# Altium project Master_V1.PrjPCB
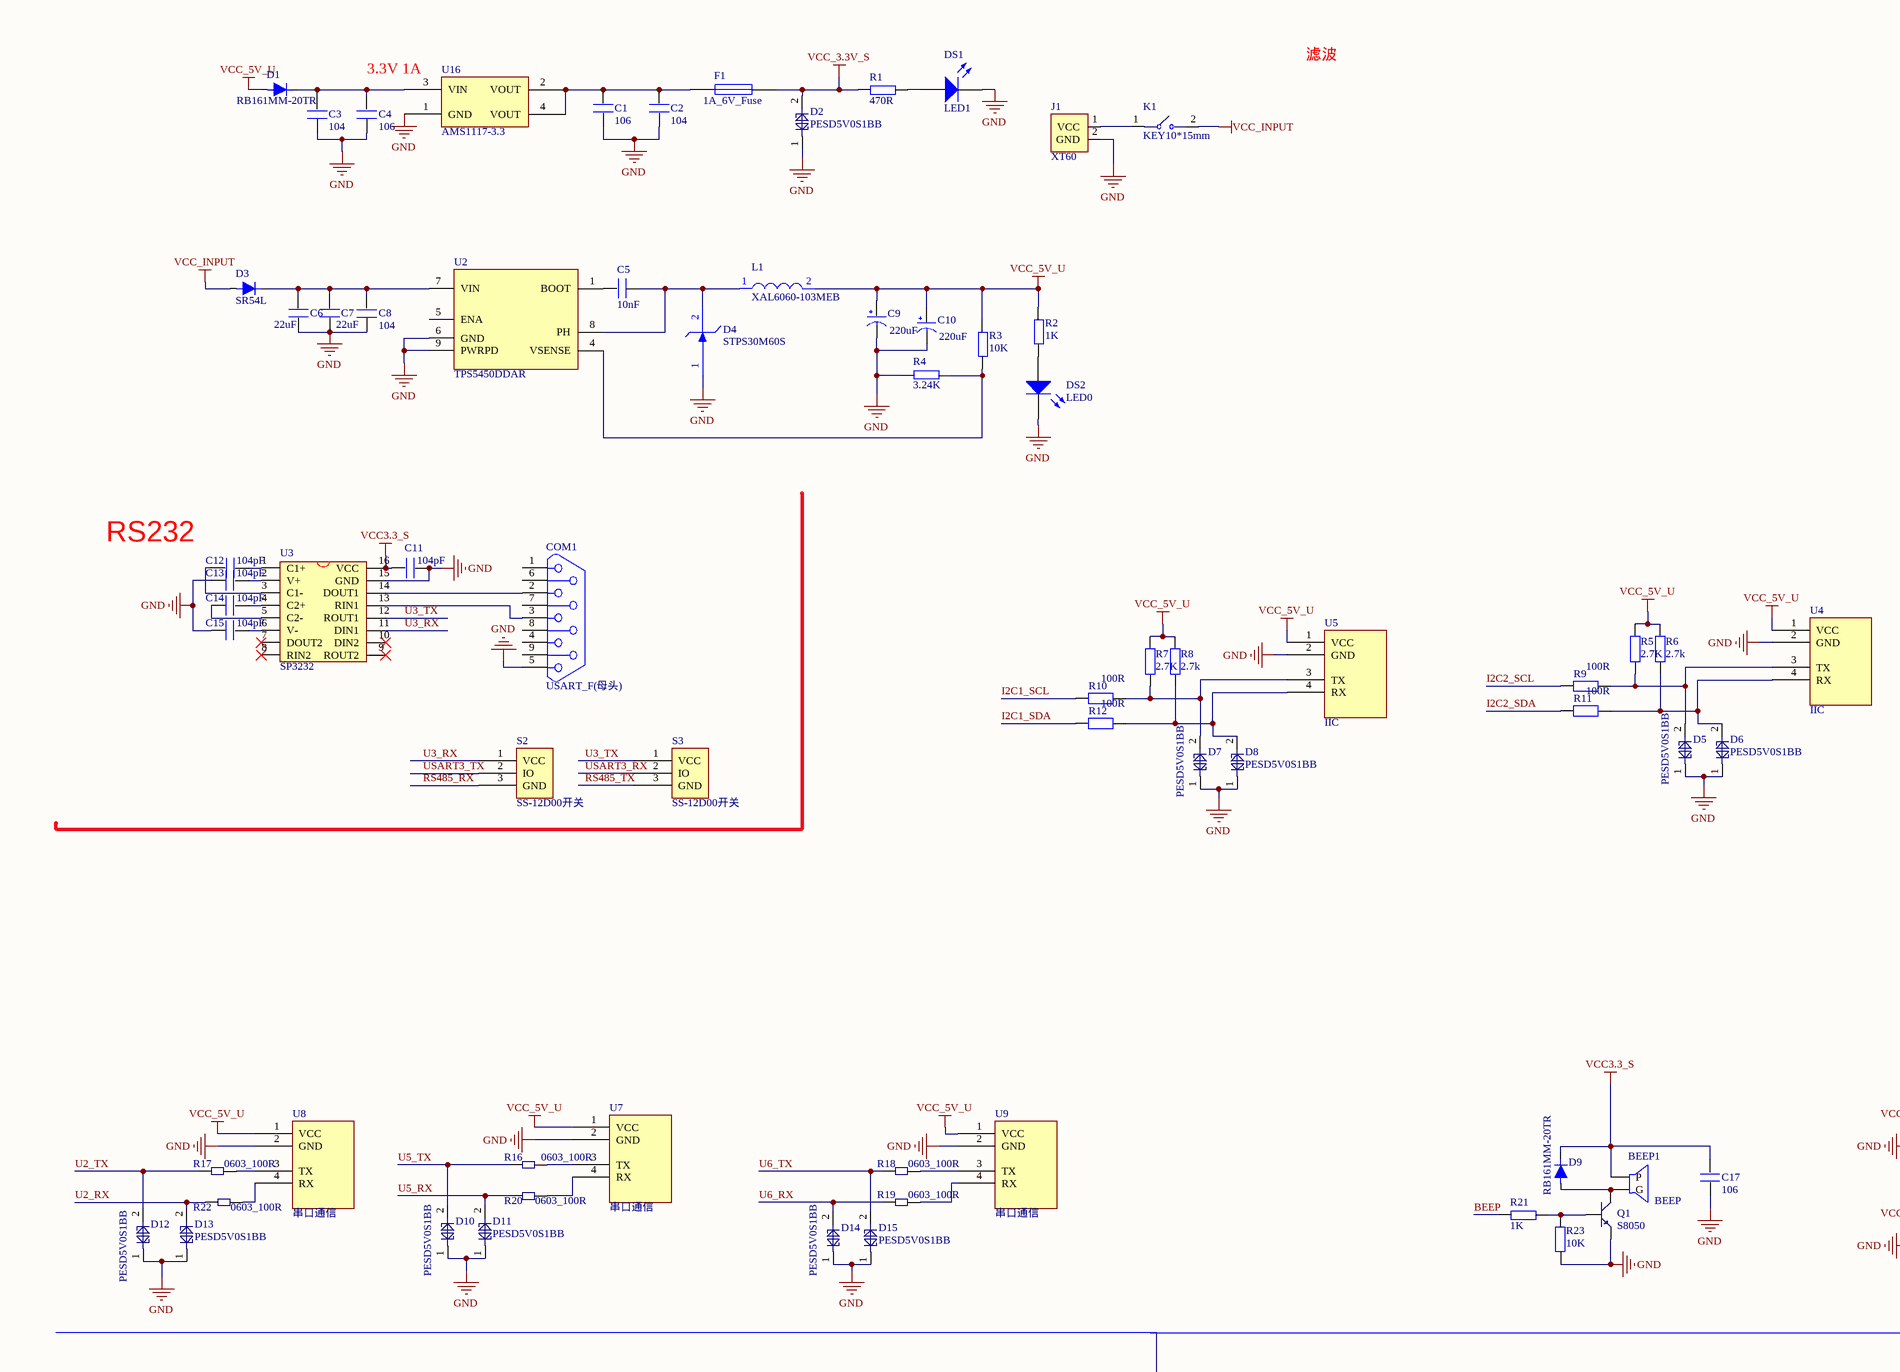
[diagram p0: Master_V1.SchDoc, top left]
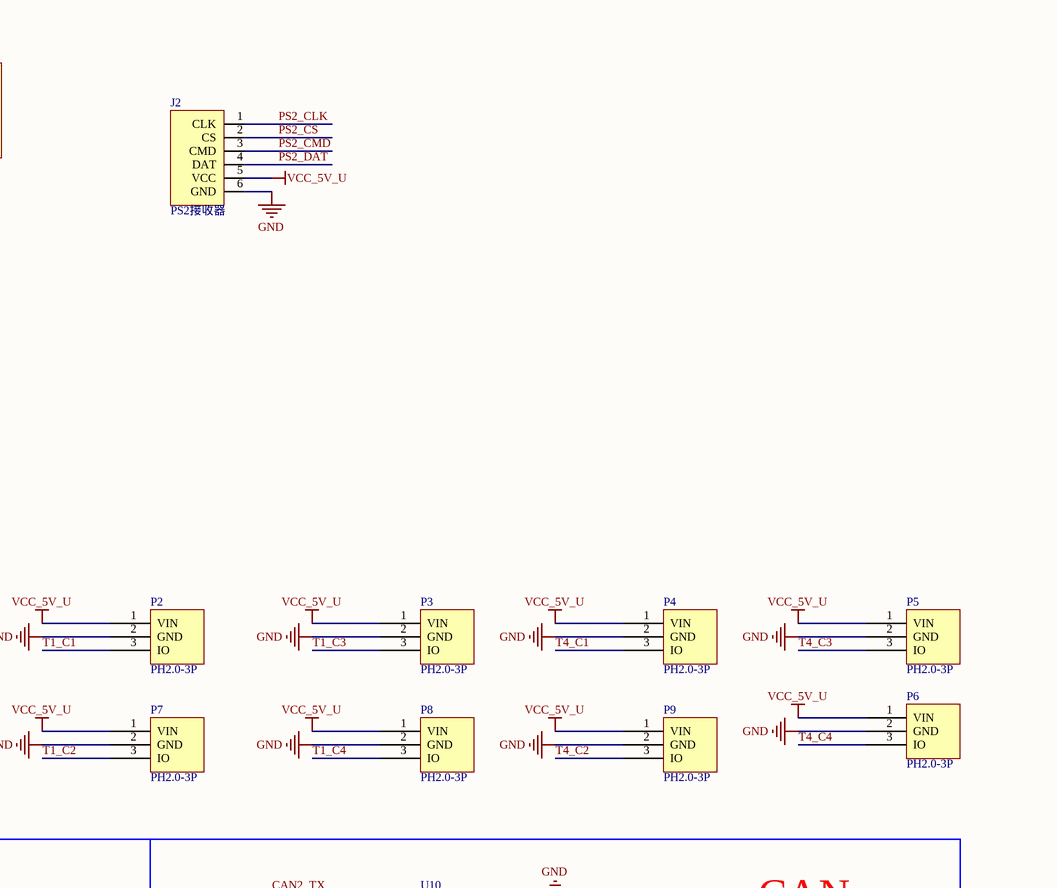
[diagram p1: Master_V1.SchDoc, top right]
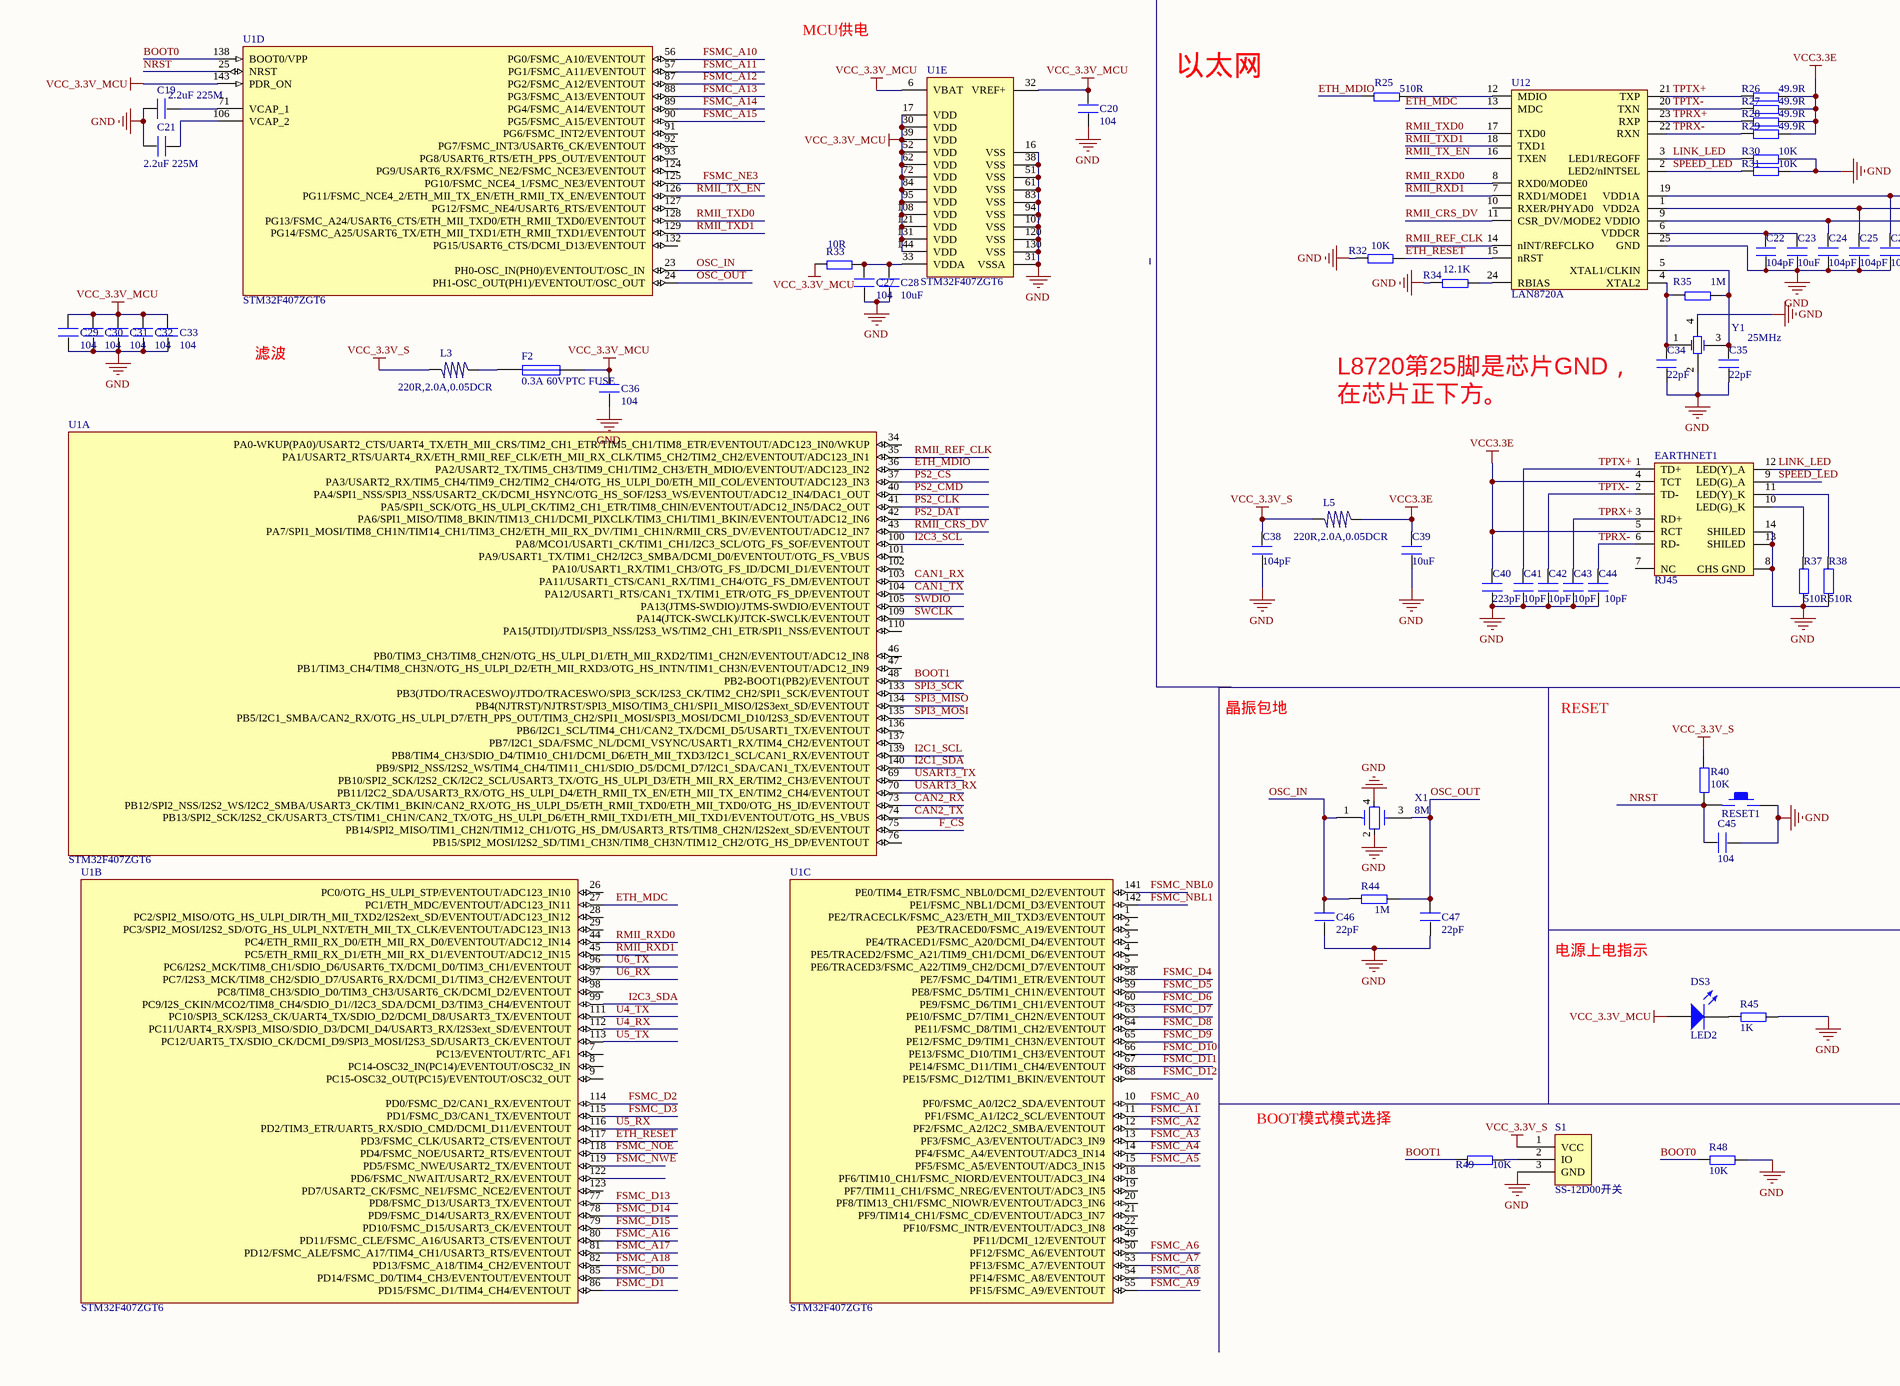
[diagram p2: Master_V1.SchDoc, bottom left]
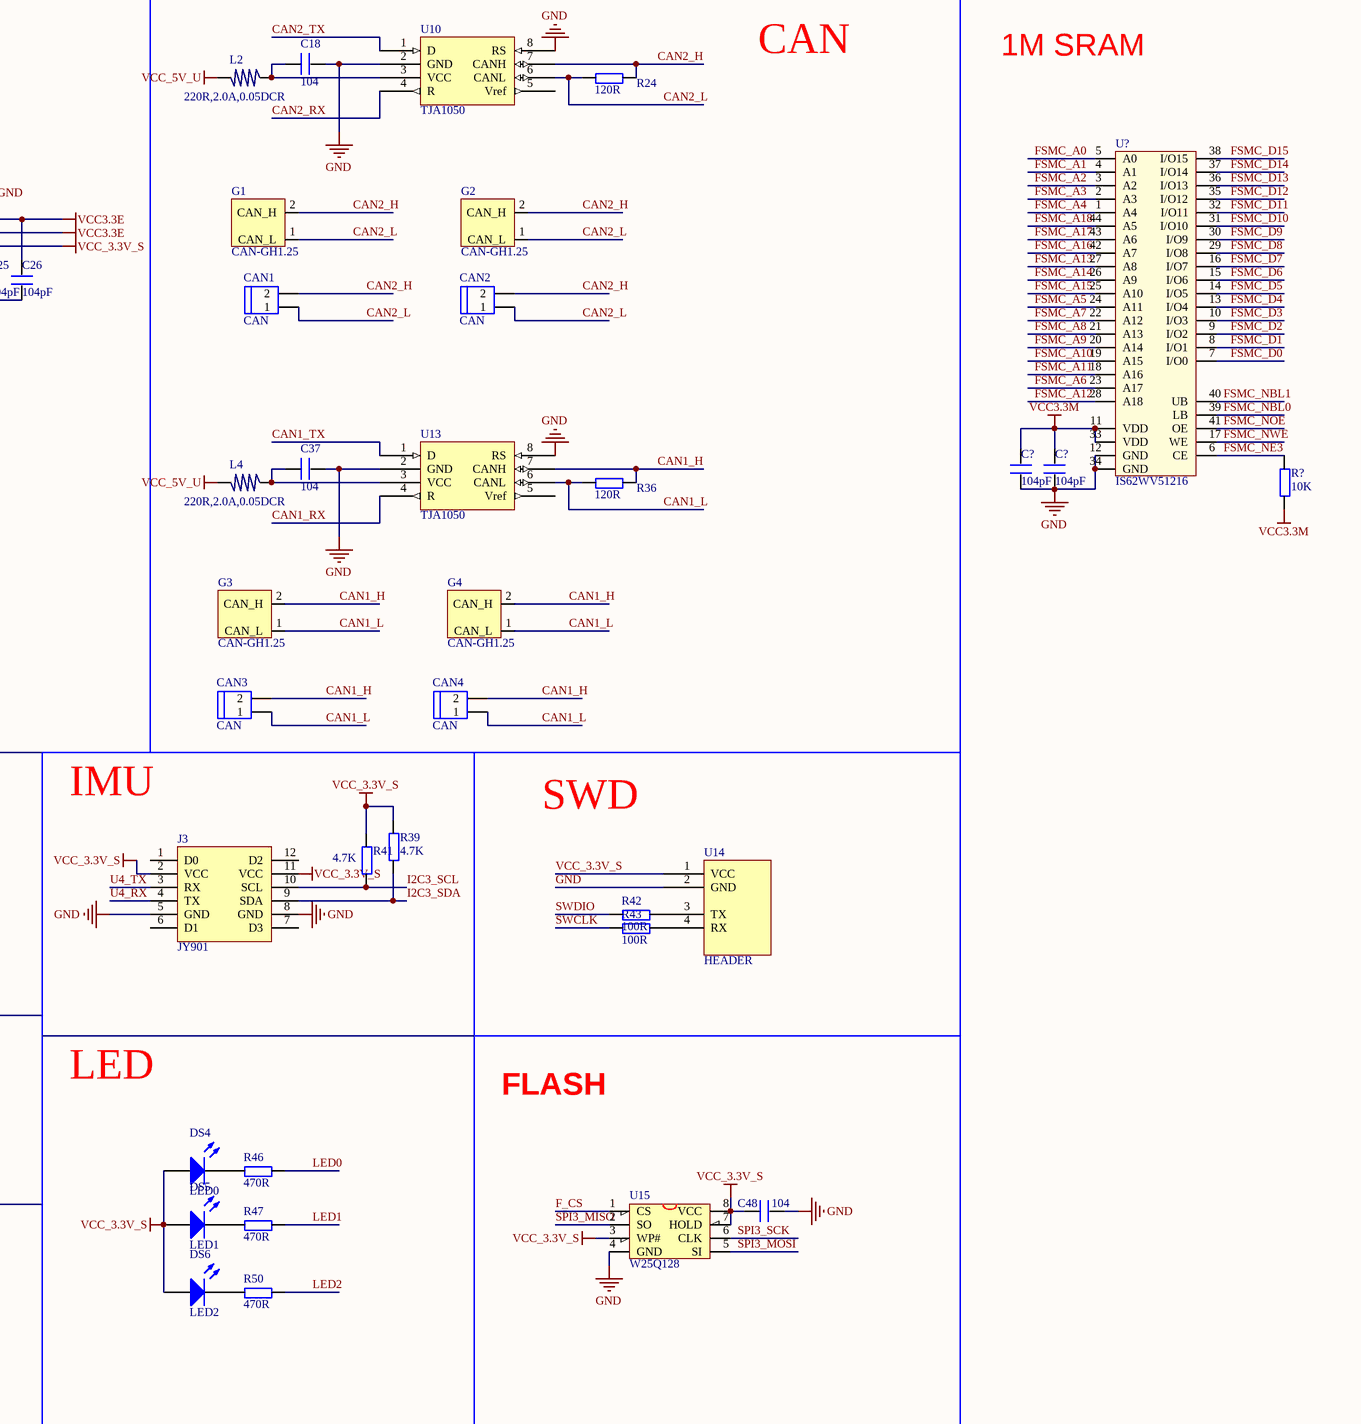
[diagram p3: Master_V1.SchDoc, bottom right]
1 sheet, 170 parts. Net scope: global (net labels, ports and power ports of the same name join across sheets).
Board file: Master_V1.PcbDoc

## Sheet Master_V1.SchDoc
size A1

### Parts
(Parts that share a designator on the sheet are numbered #1, #2 ... from top to bottom, then left to right.)
BEEP1  BEEP  [BELL-5]
C1  106  [0603C]
C2  104  [0603C]
C3  104  [0603C]
C4  106  [0603C]
C5  10nF  [0603C]
C6  22uF  [0603C]
C7  22uF  [0603C]
C8  104  [0603C]
C9  220uF  [CC6.56.5]
C10  220uF  [CC6.56.5]
C11  104pF  [C0603]
C12  104pF  [C0603]
C13  104pF  [C0603]
C14  104pF  [C0603]
C15  104pF  [C0603]
C17  106  [0603C]
C18  104  [0603P]
C19  2.2uF 225M  [0603C]
C20  104  [0603C]
C21  2.2uF 225M  [0603C]
C22  104pF  [C0603]
C23  10uF  [0603C]
C24  104pF  [C0603]
C25  104pF  [C0603]
C26  104pF  [C0603]
C27  104  [0603C]
C28  10uF  [0603C]
C29  104  [0603C]
C30  104  [0603C]
C31  104  [0603C]
C32  104  [0603C]
C33  104  [0603C]
C34  22pF  [C0603]
C35  22pF  [C0603]
C36  104  [0603C]
C37  104  [0603P]
C38  104pF  [C0603]
C39  10uF  [0603C]
C40  223pF  [C0603]
C41  10pF  [C0603]
C42  10pF  [C0603]
C43  10pF  [C0603]
C44  10pF  [C0603]
C45  104  [0603C]
C46  22pF  [0603C]
C47  22pF  [0603C]
C48  104  [0603C]
C?#1  104pF  [C0603]
C?#2  104pF  [C0603]
CAN1  CAN  [HEAD2L-0.8]
CAN2  CAN  [HEAD2L-0.8]
CAN3  CAN  [HEAD2L-0.8]
CAN4  CAN  [HEAD2L-0.8]
COM1  USART_F(母头)  [DB9]
D1  RB161MM-20TR  [LC-SOD-123F]
D2  PESD5V0S1BB  [LC-SOD-523]
D3  SR54L  [LC-SMB(DO-214AA)_S2]
D4  STPS30M60S  [STPS30M60S]
D5  PESD5V0S1BB  [LC-SOD-523]
D6  PESD5V0S1BB  [LC-SOD-523]
D7  PESD5V0S1BB  [LC-SOD-523]
D8  PESD5V0S1BB  [LC-SOD-523]
D9  RB161MM-20TR  [LC-SOD-123F]
D10  PESD5V0S1BB  [LC-SOD-523]
D11  PESD5V0S1BB  [LC-SOD-523]
D12  PESD5V0S1BB  [LC-SOD-523]
D13  PESD5V0S1BB  [LC-SOD-523]
D14  PESD5V0S1BB  [LC-SOD-523]
D15  PESD5V0S1BB  [LC-SOD-523]
DS1  LED1  [0603_LED]
DS2  LED0  [0603_LED]
DS3  LED2  [0603_LED]
DS4  LED0  [0603_LED]
DS5  LED1  [0603_LED]
DS6  LED2  [0603_LED]
EARTHNET1  RJ45  [HR911105A]
F1  1A_6V_Fuse  [LC-1206]
F2  0.3A 60VPTC FUSE  [LC-1812_R]
G1  CAN-GH1.25  [GH1.25_1*2_lishi]
G2  CAN-GH1.25  [GH1.25_1*2_lishi]
G3  CAN-GH1.25  [GH1.25_1*2_lishi]
G4  CAN-GH1.25  [GH1.25_1*2_lishi]
J1  XT60  [XT60-母头]
J2  PS2接收器  [HDR1X6]
J3  JY901  [JY901]
K1  KEY10*15mm  [10*15mm船型开关]
L1  XAL6060-103MEB  [XAL6060-103MEB]
L2  220R,2.0A,0.05DCR  [0603P]
L3  220R,2.0A,0.05DCR  [0603C]
L4  220R,2.0A,0.05DCR  [0603P]
L5  220R,2.0A,0.05DCR  [R0603]
P2  PH2.0-3P  [PH2.0-3]
P3  PH2.0-3P  [PH2.0-3]
P4  PH2.0-3P  [PH2.0-3]
P5  PH2.0-3P  [PH2.0-3]
P6  PH2.0-3P  [PH2.0-3]
P7  PH2.0-3P  [PH2.0-3]
P8  PH2.0-3P  [PH2.0-3]
P9  PH2.0-3P  [PH2.0-3]
Q1  S8050  [SOT-23R]
R1  470R  [0603R]
R2  1K  [0603R]
R3  10K  [0603R]
R4  3.24K  [0603R]
R5  2.7K  [0603R]
R6  2.7k  [0603R]
R7  2.7K  [0603R]
R8  2.7k  [0603R]
R9  100R  [0603R]
R10  100R  [0603R]
R11  100R  [0603R]
R12  100R  [0603R]
R16  0603_100R  [0603R]
R17  0603_100R  [0603R]
R18  0603_100R  [0603R]
R19  0603_100R  [0603R]
R20  0603_100R  [0603R]
R21  1K  [0603R]
R22  0603_100R  [0603R]
R23  10K  [0603R]
R24  120R  [0603P]
R25  510R  [R0603]
R26  49.9R  [R0603]
R27  49.9R  [R0603]
R28  49.9R  [R0603]
R29  49.9R  [R0603]
R30  10K  [R0603]
R31  10K  [R0603]
R32  10K  [R0603]
R33  10R  [0603R]
R34  12.1K  [R0603]
R35  1M  [R0603]
R36  120R  [0603P]
R37  510R  [R0603]
R38  510R  [R0603]
R39  4.7K  [0603P]
R40  10K  [0603R]
R41  4.7K  [0603P]
R42  100R  [0603P]
R43  100R  [0603P]
R44  1M  [0603R]
R45  1K  [0603R]
R46  470R  [0603R]
R47  470R  [0603R]
R48  10K  [0603R]
R49  10K  [0603R]
R50  470R  [0603R]
R?  10K  [R0603]
RESET1  KEY_M  [KEY_M]  (value not drawn)
S1  SS-12D00开关  [SS-12D00]
S2  SS-12D00开关  [SS-12D00]
S3  SS-12D00开关  [SS-12D00]
U1  STM32F407ZGT6  [LQFP144]  (parts A,B,C,D,E of 5)
U2  TPS5450DDAR  [TPS5450]
U3  SP3232  [SOP16M]
U4  IIC  [XH2.54-4]
U5  IIC  [XH2.54-4]
U7  串口通信  [XH2.54-4]
U8  串口通信  [XH2.54-4]
U9  串口通信  [XH2.54-4]
U10  TJA1050  [SOP8]
U12  LAN8720A  [QFN25]
U13  TJA1050  [SOP8]
U14  HEADER  [XH2.54-4]
U15  W25Q128  [SOIC-8]
U16  AMS1117-3.3  [SOT223]
U?  IS62WV51216  [TSOP44]
X1  8M  [XTAL3225   无源]
Y1  25MHz  [SMD-3225]

### Nets
GND: C1.2 C2.2 C3.2 C4.2 C6.1 C7.1 C8.2 C9.2(GND) C10.2(GND) C11.2 C13.1 C15.1 C17.2 C18.2 C19.1 C20.1 C21.2 C22.1 C23.1 C24.1 C25.1 C26.1 C27.1 C28.1 C29.1 C30.1 C31.1 C32.1 C33.1 C34.1 C35.1 C36.1 C37.2 C38.1 C39.1 C40.1 C41.1 C42.1 C43.1 C44.1 C45.2 C46.1 C47.1 C48.2 C?#1.1 C?#2.1 COM1.5 D2.1(A) D4.1(A) D5.1(A) D6.1(A) D7.1(A) D8.1(A) D10.1(A) D11.1(A) D12.1(A) D13.1(A) D14.1(A) D15.1(A) DS1.2(K) DS2.2(K) EARTHNET1.8(CHS_GND) EARTHNET1.13(SHILED) EARTHNET1.14(SHILED) J1.2(GND) J2.6(GND) J3.5(GND) J3.8(GND) P2.2(GND) P3.2(GND) P4.2(GND) P5.2(GND) P6.2(GND) P7.2(GND) P8.2(GND) P9.2(GND) Q1.1(E) R4.2 R23.2 R30.2 R31.2 R32.1 R34.1 R37.1 R38.1 R45.2 R48.2 RESET1.2 S1.3(GND) U1.16(VSS) U1.31(VSSA) U1.38(VSS) U1.51(VSS) U1.61(VSS) U1.83(VSS) U1.94(VSS) U1.107(VSS) U1.120(VSS) U1.130(VSS) U2.6(GND) U2.9(PWRPD) U3.15(GND) U4.2(GND) U5.2(GND) U7.2(GND) U8.2(GND) U9.2(GND) U10.2(GND) U10.8(RS) U12.25(GND) U13.2(GND) U13.8(RS) U14.2(GND) U15.4(GND) U16.1(GND) U?.12(GND) U?.34(GND) X1.2 X1.4 Y1.2 Y1.4
VCC3.3_S: BEEP1.1(P) C11.1 C17.1 D9.2 U3.16(VCC)
VCC3.3E: C25.2 C26.2 C39.2 C40.2 EARTHNET1.4(TCT) EARTHNET1.5(RCT) L5.1 R26.2 R27.2 R28.2 R29.2 U12.1(VDD2A) U12.19(VDD1A)
VCC3.3M: C?#1.2 C?#2.2 R?.1 U?.11(VDD) U?.33(VDD)
VCC_3.3V_MCU: C20.2 C29.2 C30.2 C31.2 C32.2 C33.2 C36.2 DS3.1(A) F2.2 R33.1 U1.6(VBAT) U1.17(VDD) U1.30(VDD) U1.32(VREF+) U1.39(VDD) U1.52(VDD) U1.62(VDD) U1.72(VDD) U1.84(VDD) U1.95(VDD) U1.108(VDD) U1.121(VDD) U1.131(VDD) U1.143(PDR_ON) U1.144(VDD)
VCC_3.3V_S: C24.2 C38.2 C48.1 D2.2(C) DS4.1(A) DS5.1(A) DS6.1(A) F1.1 J3.2(VCC) J3.11(VCC) L3.2 L5.2 R1.1 R39.2 R40.2 R41.2 S1.1(VCC) U12.9(VDDIO) U14.1(VCC) U15.3(WP#) U15.7(HOLD) U15.8(VCC)
VCC_5V_U: C9.1(VCC) C10.1(VCC) D1.1 J2.5(VCC) L1.2(VIN) L2.2 L4.2 P2.1(VIN) P3.1(VIN) P4.1(VIN) P5.1(VIN) P6.1(VIN) P7.1(VIN) P8.1(VIN) P9.1(VIN) R2.2 R3.2 R5.2 R6.2 R7.2 R8.2 U4.1(VCC) U5.1(VCC) U7.1(VCC) U8.1(VCC) U9.1(VCC)
VCC_INPUT: D3.1 K1.2
BEEP: R21.1
BOOT0: R48.1 U1.138(BOOT0/VPP)
BOOT1: R49.1 U1.48(PB2-BOOT1(PB2)/EVENTOUT)
CAN1_H: CAN3.2 CAN4.2 G3.2(CAN_H) G4.2(CAN_H) R36.2 U13.7(CANH)
CAN1_L: CAN3.1 CAN4.1 G3.1(CAN_L) G4.1(CAN_L) R36.1 U13.6(CANL)
CAN1_RX: U1.103(PA11/USART1_CTS/CAN1_RX/TIM1_CH4/OTG_FS_DM/EVENTOUT) U13.4(R)
CAN1_TX: U1.104(PA12/USART1_RTS/CAN1_TX/TIM1_ETR/OTG_FS_DP/EVENTOUT) U13.1(D)
CAN2_H: CAN1.2 CAN2.2 G1.2(CAN_H) G2.2(CAN_H) R24.2 U10.7(CANH)
CAN2_L: CAN1.1 CAN2.1 G1.1(CAN_L) G2.1(CAN_L) R24.1 U10.6(CANL)
CAN2_RX: U1.73(PB12/SPI2_NSS/I2S2_WS/I2C2_SMBA/USART3_CK/TIM1_BKIN/CAN2_RX/OTG_HS_ULPI_D5/ETH_RMII_TXD0/ETH_MII_TXD0/OTG_HS_ID/EVENTOUT) U10.4(R)
CAN2_TX: U1.74(PB13/SPI2_SCK/I2S2_CK/USART3_CTS/TIM1_CH1N/CAN2_TX/OTG_HS_ULPI_D6/ETH_RMII_TXD1/ETH_MII_TXD1/EVENTOUT/OTG_HS_VBUS) U10.1(D)
ETH_MDC: U1.27(PC1/ETH_MDC/EVENTOUT/ADC123_IN11) U12.13(MDC)
ETH_MDIO: R25.1 U1.36(PA2/USART2_TX/TIM5_CH3/TIM9_CH1/TIM2_CH3/ETH_MDIO/EVENTOUT/ADC123_IN2)
ETH_RESET: R32.2 U1.117(PD3/FSMC_CLK/USART2_CTS/EVENTOUT) U12.15(nRST)
F_CS: U1.75(PB14/SPI2_MISO/TIM1_CH2N/TIM12_CH1/OTG_HS_DM/USART3_RTS/TIM8_CH2N/I2S2ext_SD/EVENTOUT) U15.1(CS)
FSMC_A0: U1.10(PF0/FSMC_A0/I2C2_SDA/EVENTOUT) U?.5(A0)
FSMC_A1: U1.11(PF1/FSMC_A1/I2C2_SCL/EVENTOUT) U?.4(A1)
FSMC_A2: U1.12(PF2/FSMC_A2/I2C2_SMBA/EVENTOUT) U?.3(A2)
FSMC_A3: U1.13(PF3/FSMC_A3/EVENTOUT/ADC3_IN9) U?.2(A3)
FSMC_A4: U1.14(PF4/FSMC_A4/EVENTOUT/ADC3_IN14) U?.1(A4)
FSMC_A5: U1.15(PF5/FSMC_A5/EVENTOUT/ADC3_IN15) U?.24(A11)
FSMC_A6: U1.50(PF12/FSMC_A6/EVENTOUT) U?.23(A17)
FSMC_A7: U1.53(PF13/FSMC_A7/EVENTOUT) U?.22(A12)
FSMC_A8: U1.54(PF14/FSMC_A8/EVENTOUT) U?.21(A13)
FSMC_A9: U1.55(PF15/FSMC_A9/EVENTOUT) U?.20(A14)
FSMC_A10: U1.56(PG0/FSMC_A10/EVENTOUT) U?.19(A15)
FSMC_A11: U1.57(PG1/FSMC_A11/EVENTOUT) U?.18(A16)
FSMC_A12: U1.87(PG2/FSMC_A12/EVENTOUT) U?.28(A18)
FSMC_A13: U1.88(PG3/FSMC_A13/EVENTOUT) U?.27(A8)
FSMC_A14: U1.89(PG4/FSMC_A14/EVENTOUT) U?.26(A9)
FSMC_A15: U1.90(PG5/FSMC_A15/EVENTOUT) U?.25(A10)
FSMC_A16: U1.80(PD11/FSMC_CLE/FSMC_A16/USART3_CTS/EVENTOUT) U?.42(A7)
FSMC_A17: U1.81(PD12/FSMC_ALE/FSMC_A17/TIM4_CH1/USART3_RTS/EVENTOUT) U?.43(A6)
FSMC_A18: U1.82(PD13/FSMC_A18/TIM4_CH2/EVENTOUT) U?.44(A5)
FSMC_D0: U1.85(PD14/FSMC_D0/TIM4_CH3/EVENTOUT/EVENTOUT) U?.7(I/O0)
FSMC_D1: U1.86(PD15/FSMC_D1/TIM4_CH4/EVENTOUT) U?.8(I/O1)
FSMC_D2: U1.114(PD0/FSMC_D2/CAN1_RX/EVENTOUT) U?.9(I/O2)
FSMC_D3: U1.115(PD1/FSMC_D3/CAN1_TX/EVENTOUT) U?.10(I/O3)
FSMC_D4: U1.58(PE7/FSMC_D4/TIM1_ETR/EVENTOUT) U?.13(I/O4)
FSMC_D5: U1.59(PE8/FSMC_D5/TIM1_CH1N/EVENTOUT) U?.14(I/O5)
FSMC_D6: U1.60(PE9/FSMC_D6/TIM1_CH1/EVENTOUT) U?.15(I/O6)
FSMC_D7: U1.63(PE10/FSMC_D7/TIM1_CH2N/EVENTOUT) U?.16(I/O7)
FSMC_D8: U1.64(PE11/FSMC_D8/TIM1_CH2/EVENTOUT) U?.29(I/O8)
FSMC_D9: U1.65(PE12/FSMC_D9/TIM1_CH3N/EVENTOUT) U?.30(I/O9)
FSMC_D10: U1.66(PE13/FSMC_D10/TIM1_CH3/EVENTOUT) U?.31(I/O10)
FSMC_D11: U1.67(PE14/FSMC_D11/TIM1_CH4/EVENTOUT) U?.32(I/O11)
FSMC_D12: U1.68(PE15/FSMC_D12/TIM1_BKIN/EVENTOUT) U?.35(I/O12)
FSMC_D13: U1.77(PD8/FSMC_D13/USART3_TX/EVENTOUT) U?.36(I/O13)
FSMC_D14: U1.78(PD9/FSMC_D14/USART3_RX/EVENTOUT) U?.37(I/O14)
FSMC_D15: U1.79(PD10/FSMC_D15/USART3_CK/EVENTOUT) U?.38(I/O15)
FSMC_NBL0: U1.141(PE0/TIM4_ETR/FSMC_NBL0/DCMI_D2/EVENTOUT) U?.39(LB)
FSMC_NBL1: U1.142(PE1/FSMC_NBL1/DCMI_D3/EVENTOUT) U?.40(UB)
FSMC_NE3: R?.2 U1.125(PG10/FSMC_NCE4_1/FSMC_NE3/EVENTOUT) U?.6(CE)
FSMC_NOE: U1.118(PD4/FSMC_NOE/USART2_RTS/EVENTOUT) U?.41(OE)
FSMC_NWE: U1.119(PD5/FSMC_NWE/USART2_TX/EVENTOUT) U?.17(WE)
I2C1_SCL: R10.2 U1.139(PB8/TIM4_CH3/SDIO_D4/TIM10_CH1/DCMI_D6/ETH_MII_TXD3/I2C1_SCL/CAN1_RX/EVENTOUT)
I2C1_SDA: R12.2 U1.140(PB9/SPI2_NSS/I2S2_WS/TIM4_CH4/TIM11_CH1/SDIO_D5/DCMI_D7/I2C1_SDA/CAN1_TX/EVENTOUT)
I2C2_SCL: R9.2
I2C2_SDA: R11.2
I2C3_SCL: J3.10(SCL) R41.1 U1.100(PA8/MCO1/USART1_CK/TIM1_CH1/I2C3_SCL/OTG_FS_SOF/EVENTOUT)
I2C3_SDA: J3.9(SDA) R39.1 U1.99(PC9/I2S_CKIN/MCO2/TIM8_CH4/SDIO_D1//I2C3_SDA/DCMI_D3/TIM3_CH4/EVENTOUT)
LED0: R46.2
LED1: R47.2
LED2: R50.2
LINK_LED: EARTHNET1.12(LED(Y)_A) R30.1 U12.3(LED1/REGOFF)
NRST: C45.1 R40.1 RESET1.1 U1.25(NRST)
OSC_IN: C46.2 R44.1 U1.23(PH0-OSC_IN(PH0)/EVENTOUT/OSC_IN) X1.1
OSC_OUT: C47.2 R44.2 U1.24(PH1-OSC_OUT(PH1)/EVENTOUT/OSC_OUT) X1.3
PS2_CLK: J2.1(CLK) U1.41(PA5/SPI1_SCK/OTG_HS_ULPI_CK/TIM2_CH1_ETR/TIM8_CHIN/EVENTOUT/ADC12_IN5/DAC2_OUT)
PS2_CMD: J2.3(CMD) U1.40(PA4/SPI1_NSS/SPI3_NSS/USART2_CK/DCMI_HSYNC/OTG_HS_SOF/I2S3_WS/EVENTOUT/ADC12_IN4/DAC1_OUT)
PS2_CS: J2.2(CS) U1.37(PA3/USART2_RX/TIM5_CH4/TIM9_CH2/TIM2_CH4/OTG_HS_ULPI_D0/ETH_MII_COL/EVENTOUT/ADC123_IN3)
PS2_DAT: J2.4(DAT) U1.42(PA6/SPI1_MISO/TIM8_BKIN/TIM13_CH1/DCMI_PIXCLK/TIM3_CH1/TIM1_BKIN/EVENTOUT/ADC12_IN6)
RMII_CRS_DV: U1.43(PA7/SPI1_MOSI/TIM8_CH1N/TIM14_CH1/TIM3_CH2/ETH_MII_RX_DV/TIM1_CH1N/RMII_CRS_DV/EVENTOUT/ADC12_IN7) U12.11(CSR_DV/MODE2)
RMII_REF_CLK: U1.35(PA1/USART2_RTS/UART4_RX/ETH_RMII_REF_CLK/ETH_MII_RX_CLK/TIM5_CH2/TIM2_CH2/EVENTOUT/ADC123_IN1) U12.14(nINT/REFCLKO)
RMII_RXD0: U1.44(PC4/ETH_RMII_RX_D0/ETH_MII_RX_D0/EVENTOUT/ADC12_IN14) U12.8(RXD0/MODE0)
RMII_RXD1: U1.45(PC5/ETH_RMII_RX_D1/ETH_MII_RX_D1/EVENTOUT/ADC12_IN15) U12.7(RXD1/MODE1)
RMII_TX_EN: U1.126(PG11/FSMC_NCE4_2/ETH_MII_TX_EN/ETH_RMII_TX_EN/EVENTOUT) U12.16(TXEN)
RMII_TXD0: U1.128(PG13/FSMC_A24/USART6_CTS/ETH_MII_TXD0/ETH_RMII_TXD0/EVENTOUT) U12.17(TXD0)
RMII_TXD1: U1.129(PG14/FSMC_A25/USART6_TX/ETH_MII_TXD1/ETH_RMII_TXD1/EVENTOUT) U12.18(TXD1)
RS485_RX: S2.3(GND)
RS485_TX: S3.3(GND)
SPEED_LED: EARTHNET1.9(LED(G)_A) R31.1 U12.2(LED2/nINTSEL)
SPI3_MISO: U1.134(PB4(NJTRST)/NJTRST/SPI3_MISO/TIM3_CH1/SPI1_MISO/I2S3ext_SD/EVENTOUT) U15.2(SO)
SPI3_MOSI: U1.135(PB5/I2C1_SMBA/CAN2_RX/OTG_HS_ULPI_D7/ETH_PPS_OUT/TIM3_CH2/SPI1_MOSI/SPI3_MOSI/DCMI_D10/I2S3_SD/EVENTOUT) U15.5(SI)
SPI3_SCK: U1.133(PB3(JTDO/TRACESWO)/JTDO/TRACESWO/SPI3_SCK/I2S3_CK/TIM2_CH2/SPI1_SCK/EVENTOUT) U15.6(CLK)
SWCLK: R43.1 U1.109(PA14(JTCK-SWCLK)/JTCK-SWCLK/EVENTOUT)
SWDIO: R42.1 U1.105(PA13(JTMS-SWDIO)/JTMS-SWDIO/EVENTOUT)
T1_C1: P2.3(IO)
T1_C2: P7.3(IO)
T1_C3: P3.3(IO)
T1_C4: P8.3(IO)
T4_C1: P4.3(IO)
T4_C2: P9.3(IO)
T4_C3: P5.3(IO)
T4_C4: P6.3(IO)
TPRX+: C43.2 EARTHNET1.3(RD+) R28.1 U12.23(RXP)
TPRX-: C44.2 EARTHNET1.6(RD-) R29.1 U12.22(RXN)
TPTX+: C41.2 EARTHNET1.1(TD+) R26.1 U12.21(TXP)
TPTX-: C42.2 EARTHNET1.2(TD-) R27.1 U12.20(TXN)
U2_RX: D13.2(C) R22.1
U2_TX: D12.2(C) R17.1
U3_RX: S2.1(VCC) U3.11(DIN1)
U3_TX: S3.1(VCC) U3.12(ROUT1)
U4_RX: J3.4(TX) U1.112(PC11/UART4_RX/SPI3_MISO/SDIO_D3/DCMI_D4/USART3_RX/I2S3ext_SD/EVENTOUT)
U4_TX: J3.3(RX) U1.111(PC10/SPI3_SCK/I2S3_CK/UART4_TX/SDIO_D2/DCMI_D8/USART3_TX/EVENTOUT)
U5_RX: D11.2(C) R20.1 U1.116(PD2/TIM3_ETR/UART5_RX/SDIO_CMD/DCMI_D11/EVENTOUT)
U5_TX: D10.2(C) R16.1 U1.113(PC12/UART5_TX/SDIO_CK/DCMI_D9/SPI3_MOSI/I2S3_SD/USART3_CK/EVENTOUT)
U6_RX: D14.2(C) R19.1 U1.97(PC7/I2S3_MCK/TIM8_CH2/SDIO_D7/USART6_RX/DCMI_D1/TIM3_CH2/EVENTOUT)
U6_TX: D15.2(C) R18.1 U1.96(PC6/I2S2_MCK/TIM8_CH1/SDIO_D6/USART6_TX/DCMI_D0/TIM3_CH1/EVENTOUT)
USART3_RX: S3.2(IO) U1.70(PB11/I2C2_SDA/USART3_RX/OTG_HS_ULPI_D4/ETH_RMII_TX_EN/ETH_MII_TX_EN/TIM2_CH4/EVENTOUT)
USART3_TX: S2.2(IO) U1.69(PB10/SPI2_SCK/I2S2_CK/I2C2_SCL/USART3_TX/OTG_HS_ULPI_D3/ETH_MII_RX_ER/TIM2_CH3/EVENTOUT)
NetBEEP1_2: BEEP1.2(G) D9.1 Q1.3(C)
NetC1_1: C1.1 C2.1 F1.2 U16.2(VOUT) U16.4(VOUT)
NetC3_1: C3.1 C4.1 D1.2 U16.3(VIN)
NetC5_1: C5.1 D4.2(K) L1.1(VIN) U2.8(PH)
NetC5_2: C5.2 U2.1(BOOT)
NetC6_2: C6.2 C7.2 C8.1 D3.2 U2.7(VIN)
NetC12_1: C12.1 U3.1(C1+)
NetC12_2: C12.2 U3.3(C1-)
NetC13_2: C13.2 U3.2(V+)
NetC14_1: C14.1 U3.5(C2-)
NetC14_2: C14.2 U3.4(C2+)
NetC15_2: C15.2 U3.6(V-)
NetC18_1: C18.1 L2.1 U10.3(VCC)
NetC19_2: C19.2 U1.71(VCAP_1)
NetC21_1: C21.1 U1.106(VCAP_2)
NetC22_2: C22.2 C23.2 U12.6(VDDCR)
NetC27_2: C27.2 C28.2 R33.2 U1.33(VDDA)
NetC34_2: C34.2 R35.1 U12.4(XTAL2) Y1.1
NetC35_2: C35.2 R35.2 U12.5(XTAL1/CLKIN) Y1.3
NetC37_1: C37.1 L4.1 U13.3(VCC)
NetCOM1_2: COM1.2 U3.14(DOUT1)
NetCOM1_3: COM1.3 U3.13(RIN1)
NetD5_2: D5.2(C) R5.1 R9.1 U4.3(TX)
NetD6_2: D6.2(C) R6.1 R11.1 U4.4(RX)
NetD7_2: D7.2(C) R7.1 R10.1 U5.3(TX)
NetD8_2: D8.2(C) R8.1 R12.1 U5.4(RX)
NetDS1_1: DS1.1(A) R1.2
NetDS2_1: DS2.1(A) R2.1
NetDS3_2: DS3.2(K) R45.1
NetDS4_2: DS4.2(K) R46.1
NetDS5_2: DS5.2(K) R47.1
NetDS6_2: DS6.2(K) R50.1
NetEARTHNET1_10: EARTHNET1.10(LED(G)_K) R37.2
NetEARTHNET1_11: EARTHNET1.11(LED(Y)_K) R38.2
NetF2_1: F2.1 L3.1
NetJ1_1: J1.1(VCC) K1.1
NetQ1_2: Q1.2(B) R21.2 R23.1
NetR3_1: R3.1 R4.1 U2.4(VSENSE)
NetR16_2: R16.2 U7.3(TX)
NetR17_2: R17.2 U8.3(TX)
NetR18_2: R18.2 U9.3(TX)
NetR19_2: R19.2 U9.4(RX)
NetR20_2: R20.2 U7.4(RX)
NetR22_2: R22.2 U8.4(RX)
NetR25_2: R25.2 U12.12(MDIO)
NetR34_2: R34.2 U12.24(RBIAS)
NetR42_2: R42.2 U14.3(TX)
NetR43_2: R43.2 U14.4(RX)
NetR49_2: R49.2 S1.2(IO)

Not connected (* = marked no-connect by the designer): COM1 1 4 6 7 8 9; EARTHNET1 7(NC); J3 1(D0) 6(D1) 7(D3) 12(D2); U1 1(PE2/TRACECLK/FSMC_A23/ETH_MII_TXD3/EVENTOUT) 2(PE3/TRACED0/FSMC_A19/EVENTOUT) 3(PE4/TRACED1/FSMC_A20/DCMI_D4/EVENTOUT) 4(PE5/TRACED2/FSMC_A21/TIM9_CH1/DCMI_D6/EVENTOUT) 5(PE6/TRACED3/FSMC_A22/TIM9_CH2/DCMI_D7/EVENTOUT) 7(PC13/EVENTOUT/RTC_AF1) 8(PC14-OSC32_IN(PC14)/EVENTOUT/OSC32_IN) 9(PC15-OSC32_OUT(PC15)/EVENTOUT/OSC32_OUT) 18(PF6/TIM10_CH1/FSMC_NIORD/EVENTOUT/ADC3_IN4) 19(PF7/TIM11_CH1/FSMC_NREG/EVENTOUT/ADC3_IN5) 20(PF8/TIM13_CH1/FSMC_NIOWR/EVENTOUT/ADC3_IN6) 21(PF9/TIM14_CH1/FSMC_CD/EVENTOUT/ADC3_IN7) 22(PF10/FSMC_INTR/EVENTOUT/ADC3_IN8) 26(PC0/OTG_HS_ULPI_STP/EVENTOUT/ADC123_IN10) 28(PC2/SPI2_MISO/OTG_HS_ULPI_DIR/TH_MII_TXD2/I2S2ext_SD/EVENTOUT/ADC123_IN12) 29(PC3/SPI2_MOSI/I2S2_SD/OTG_HS_ULPI_NXT/ETH_MII_TX_CLK/EVENTOUT/ADC123_IN13) 34(PA0-WKUP(PA0)/USART2_CTS/UART4_TX/ETH_MII_CRS/TIM2_CH1_ETR/TIM5_CH1/TIM8_ETR/EVENTOUT/ADC123_IN0/WKUP) 46(PB0/TIM3_CH3/TIM8_CH2N/OTG_HS_ULPI_D1/ETH_MII_RXD2/TIM1_CH2N/EVENTOUT/ADC12_IN8) 47(PB1/TIM3_CH4/TIM8_CH3N/OTG_HS_ULPI_D2/ETH_MII_RXD3/OTG_HS_INTN/TIM1_CH3N/EVENTOUT/ADC12_IN9) 49(PF11/DCMI_12/EVENTOUT) 76(PB15/SPI2_MOSI/I2S2_SD/TIM1_CH3N/TIM8_CH3N/TIM12_CH2/OTG_HS_DP/EVENTOUT) 91(PG6/FSMC_INT2/EVENTOUT) 92(PG7/FSMC_INT3/USART6_CK/EVENTOUT) 93(PG8/USART6_RTS/ETH_PPS_OUT/EVENTOUT) 98(PC8/TIM8_CH3/SDIO_D0/TIM3_CH3/USART6_CK/DCMI_D2/EVENTOUT) 101(PA9/USART1_TX/TIM1_CH2/I2C3_SMBA/DCMI_D0/EVENTOUT/OTG_FS_VBUS) 102(PA10/USART1_RX/TIM1_CH3/OTG_FS_ID/DCMI_D1/EVENTOUT) 110(PA15(JTDI)/JTDI/SPI3_NSS/I2S3_WS/TIM2_CH1_ETR/SPI1_NSS/EVENTOUT) 122(PD6/FSMC_NWAIT/USART2_RX/EVENTOUT) 123(PD7/USART2_CK/FSMC_NE1/FSMC_NCE2/EVENTOUT) 124(PG9/USART6_RX/FSMC_NE2/FSMC_NCE3/EVENTOUT) 127(PG12/FSMC_NE4/USART6_RTS/EVENTOUT) 132(PG15/USART6_CTS/DCMI_D13/EVENTOUT) 136(PB6/I2C1_SCL/TIM4_CH1/CAN2_TX/DCMI_D5/USART1_TX/EVENTOUT) 137(PB7/I2C1_SDA/FSMC_NL/DCMI_VSYNC/USART1_RX/TIM4_CH2/EVENTOUT); U2 5(ENA); U3 7(DOUT2)* 8(RIN2)* 9(ROUT2)* 10(DIN2)*; U10 5(Vref); U12 10(RXER/PHYAD0); U13 5(Vref)

### Notes on the sheet
- 3.3V 1A
- 滤波
- RS232
- MCU供电
- CAN
- 1M SRAM
- 以太网
- (near C34) L8720第25脚是芯片GND，在芯片正下方。
- 晶振包地
- RESET
- IMU
- SWD
- 电源上电指示
- LED
- FLASH
- BOOT模式模式选择

### Library data of the parts
C1-C8 C11-C15 C17-C19 C21-C48 C?#1 C?#2 = C
C9 C10 = CAP
C20 = C_1
CAN1-CAN4 = HEAD2
COM1 = DB9
D1 D3 D9 = 肖特基
D2 D5-D8 D10-D15 = SMAJ28CA
DS1-DS6 = LED2: Typical RED, GREEN, YELLOW, AMBER GaAs LED; Published: 8-Jun-2000; LatestRevisionDate: 17-Jul-2002; LatestRevisionNote: Re-released for DXP Platform.; PackageDocument: Feb-2002; PackageReference: 3.2X1.6X1.1; Publisher: Altium Limited
EARTHNET1 = HR911105
F1 F2 = Fuse 1_2: Fuse; Published: 8-Jun-2000; LatestRevisionDate: 17-Jul-2002; LatestRevisionNote: Re-released for DXP Platform.; PackageReference: PIN-W2/E2.8; Publisher: Altium Limited; PackageDescription: Thru-Hole; 2 Leads
G1-G4 = GH1.25-CAN
J1 = KF2_5.08
J3 = JY901-PAD
K1 = 10*15船型开关
L1 = 贴片电感
L2-L5 = L
P2-P9 = XH2.54插座-3P
Q1 = NPN: 8050/BCW846/BCW847
R1-R4 R21 R23-R50 R? = R
R5-R12 = R-0805
R16-R20 R22 = RES
S1-S3 = SS-12D00
U1 = STM32F407ZGT6: ARM Cortex-M4 32b MCU+FPU, 210DMIP, 1024 kB Flash, 192+4 kB RAM, Camera, 114 I/Os, 144-pin LQFP, -40 to +85癈, Tray; Internal RAM: 192kB; Operating Frequency (Processor Speed): 168MHz; A/D Converter: 24x12-bit; D/A Converter: 2x12-bit; 16-bit Timers (IC/OC/PWM): 12x16-bit(24/24/30); 32-bit Timer (IC/OC/PWM): 2x32-bit (8/8/8); Other Timer Functions: 2xWDG, RTC, 24-bit down counter; Serial Interface: 3xSPI/2xI2S/2xI2C/3xUSART(IrDa, ISO7816)/3xUART/2xUSB OTG FS/HS, 2xCAN/Ethernet MAC10/100, SDIO; DatasheetVersion: rev2, Jan-2012; PackageVersion: 2012; PackageReference: TQFP144; PackageDescription: 144-Pin Low Profile Quad Flat Package, 20x20 mm Body, 0.5 mm Pitch; ComponentLink1Description: Manufacturer URL; ComponentLink1URL: http://www.st.com/; ComponentLink2Description: STM32F405/7 Datasheet; ComponentLink2URL: http://www.st.com/internet/com/TECHNICAL_RESOURCES/TECHNICAL_LITERATURE/DATASHEET/DM00037051.pdf; ComponentLink3Description: STM32F4 Web Page; ComponentLink3URL: http://www.st.com/internet/mcu/subclass/1521.jsp
U2 = TPS5450
U3 = MAX3232
U4 U5 U7-U9 U14 = XH2.54插座-4P
U10 U13 = SN65HVD230D
U12 = LAN8720: ETH PHY
U15 = W25X16: W25X16;SST25VF016;MX25L1605
U16 = AMS1117
X1 = CRYSTAL
Y1 = XTAL: Crystal Oscillator; Published: 8-Jun-2000; LatestRevisionDate: 17-Jul-2002; LatestRevisionNote: Re-released for DXP Platform.; Publisher: Altium Limited